# EAGLE design esp32c3-devboard (EAGLE 9.6.2)
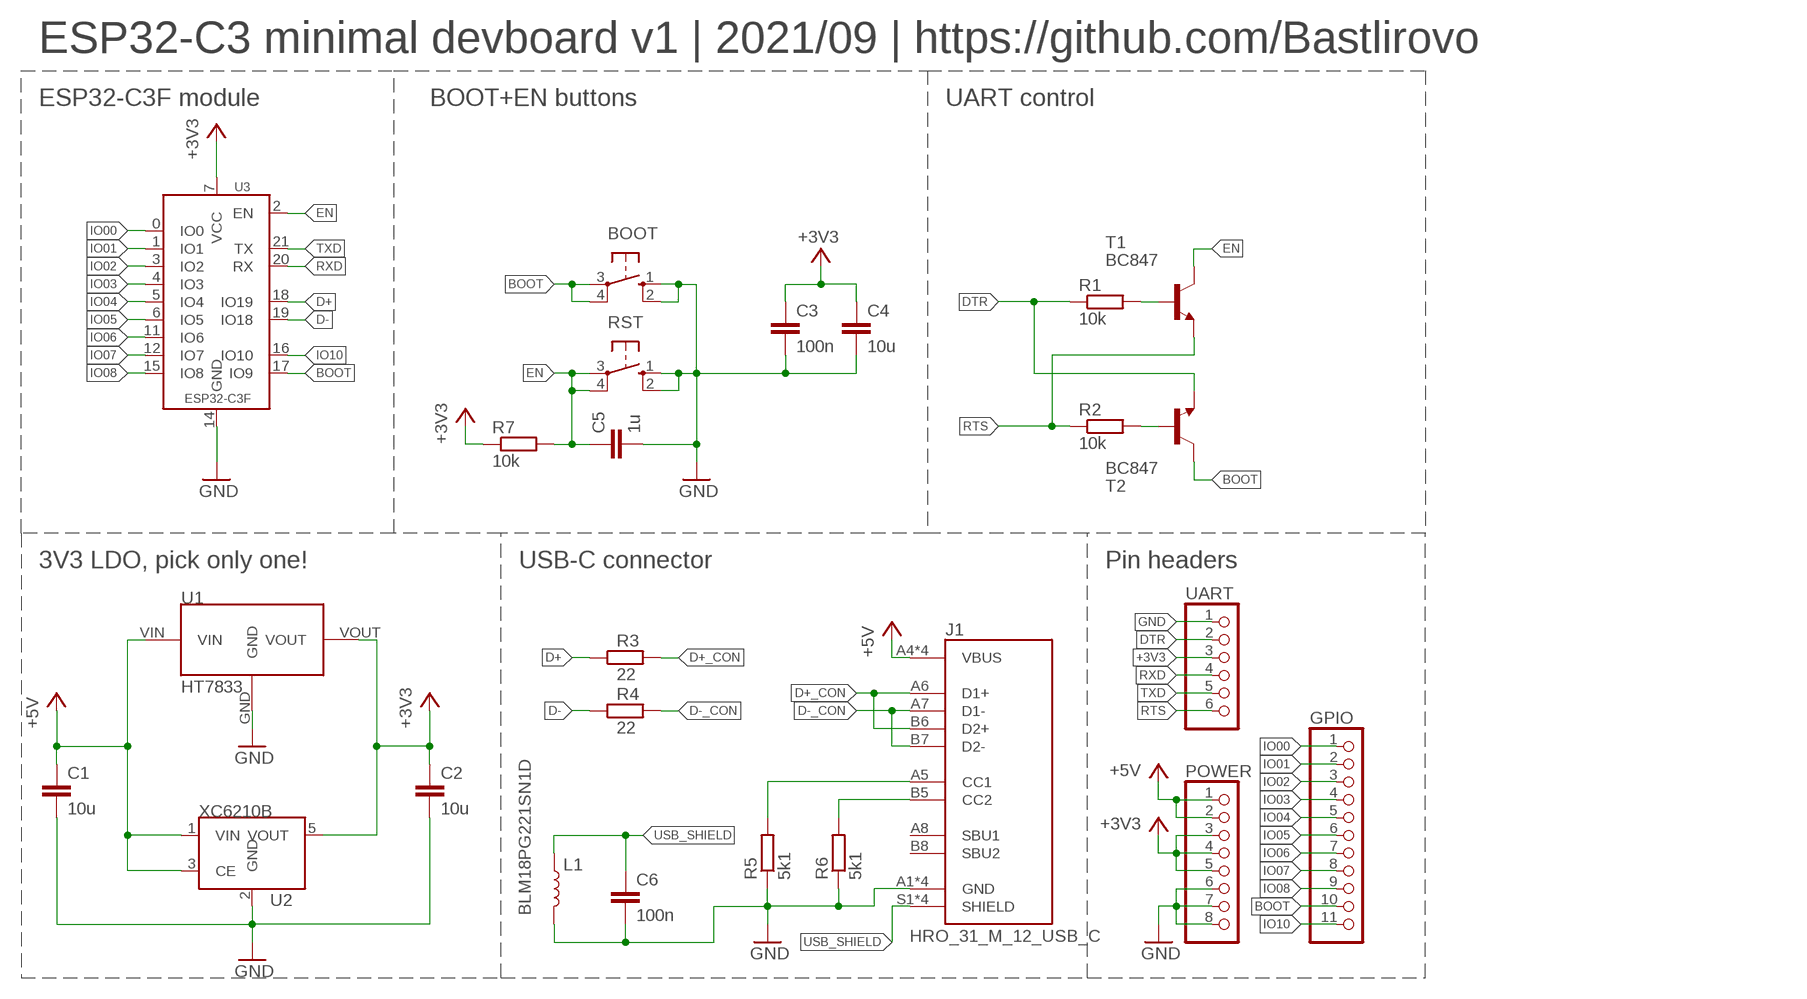
[diagram p0: schematic, sheet 1]

## Parts
BOOT  10-XX  [B3F-10XX]
C1  10u  C-EUC0603  [C0603]
C2  10u  C-EUC0603  [C0603]
C3  100n  C-EUC0603  [C0603]
C4  10u  C-EUC0603  [C0603]
C5  1u  C-EUC0603  [C0603]
C6  100n  C-EUC0603  [C0603]
GPIO  PINHD-1X11  [1X11]
J1  HRO_31_M_12_USB_C  [HRO_31_M_12_USB_C]
L1  BLM18PG221SN1D  INDUCTOR-0603-33NH  [0603]
POWER  PINHD-1X8  [1X08]
R1  10k  R-EU_R0603  [R0603]
R2  10k  R-EU_R0603  [R0603]
R3  22  R-EU_R0603  [R0603]
R4  22  R-EU_R0603  [R0603]
R5  5k1  R-EU_R0603  [R0603]
R6  5k1  R-EU_R0603  [R0603]
R7  10k  R-EU_R0603  [R0603]
RST  10-XX  [B3F-10XX]
T1  BC847  [SOT23]
T2  BC847  [SOT23]
U1  HT7833  [SOT89]
U2  XC6210  [SOT-23-5]
U3  ESP32-C3F  [ESP32-C3F]
UART  PINHD-1X6  [1X06]

## Nets
+3V3: C2.1 C3.1 C4.1 POWER.3 POWER.4 POWER.5 R7.1 U1.VOUT U2.5(VOUT) U3.7(VCC) UART.3
+5V: C1.1 J1.A4(VBUS) J1.A9(VBUS) J1.B4(VBUS) J1.B9(VBUS) POWER.1 POWER.2 U1.VIN U2.1(VIN) U2.3(CE)
BOOT: BOOT.3(P) BOOT.4(P1) GPIO.10 T2.3(C) U3.17(IO9)
D+: R3.1 U3.18(IO19)
D+_CON: J1.A6(D1+) J1.B6(D2+) R3.2
D-: R4.1 U3.19(IO18)
D-_CON: J1.A7(D1-) J1.B7(D2-) R4.2
DTR: R1.1 T2.2(E) UART.2
EN: C5.1 R7.2 RST.3(P) RST.4(P1) T1.3(C) U3.2(EN)
GND: BOOT.1(S) BOOT.2(S1) C1.2 C2.2 C3.2 C4.2 C5.2 C6.2 J1.A1(GND) J1.A12(GND) J1.B1(GND) J1.B12(GND) L1.2 POWER.6 POWER.7 POWER.8 R5.1 R6.1 RST.1(S) RST.2(S1) U1.GND U2.2(GND) U3.14(GND) UART.1
IO00: GPIO.1 U3.0(IO0)
IO01: GPIO.2 U3.1(IO1)
IO02: GPIO.3 U3.3(IO2)
IO03: GPIO.4 U3.4(IO3)
IO04: GPIO.5 U3.5(IO4)
IO05: GPIO.6 U3.6(IO5)
IO06: GPIO.7 U3.11(IO6)
IO07: GPIO.8 U3.12(IO7)
IO08: GPIO.9 U3.15(IO8)
IO10: GPIO.11 U3.16(IO10)
N$2: R2.2 T2.1(B)
N$4: R1.2 T1.1(B)
N$10: J1.A5(CC1) R5.2
N$11: J1.B5(CC2) R6.2
RTS: R2.1 T1.2(E) UART.6
RXD: U3.20(RX) UART.4
TXD: U3.21(TX) UART.5
USB_SHIELD: C6.1 J1.S1(SHIELD) J1.S2(SHIELD) J1.S3(SHIELD) J1.S4(SHIELD) L1.1
Unconnected: J1.A8(SBU1) J1.B8(SBU2)

## Notes on the sheet
- ESP32-C3 minimal devboard v1 | 2021/09 | https://github.com/Bastlirovo
- ESP32-C3F module | BOOT+EN buttons | UART control
- 3V3 LDO, pick only one! | USB-C connector | Pin headers

## Library data of the parts
BOOT RST = switch-omron:10-XX: OMRON SWITCH; MPN: B3F-1000; OC_FARNELL: 176432; OC_NEWARK: 36M3542
C1-C6 = rcl:C-EU: CAPACITOR, European symbol; SPICEPREFIX: C
GPIO = pinhead:PINHD-1X11: PIN HEADER
J1 = Bastlir:HRO_31_M_12_USB_C: USB Shielded I/O Receptacle; Type C; Right Angle; Surface Mount; Gold over Nickel
L1 = SparkFun-Coils:INDUCTOR: Inductors Resist changes in electrical current. Basically a coil of wire. SparkFun Products: SparkFun Load Cell Amplifier - HX711 <https://www.sparkfun.com/products/13879> IOIO-OTG - V2.2 <https://www.sparkfun.com/products/13613>; PROD_ID: NDUC-07874; VALUE: 33nH/±5%/500mA
POWER = pinhead:PINHD-1X8: PIN HEADER
R1-R7 = rcl:R-EU_: RESISTOR, European symbol; SPICEPREFIX: R
T1 T2 = transistor:BC847: NPN TRANSISTOR
U1 = Bastlir:HT7833
U2 = Bastlir:XC6210
U3 = Bastlir:ESP32-C3F
UART = pinhead:PINHD-1X6: PIN HEADER

## Board
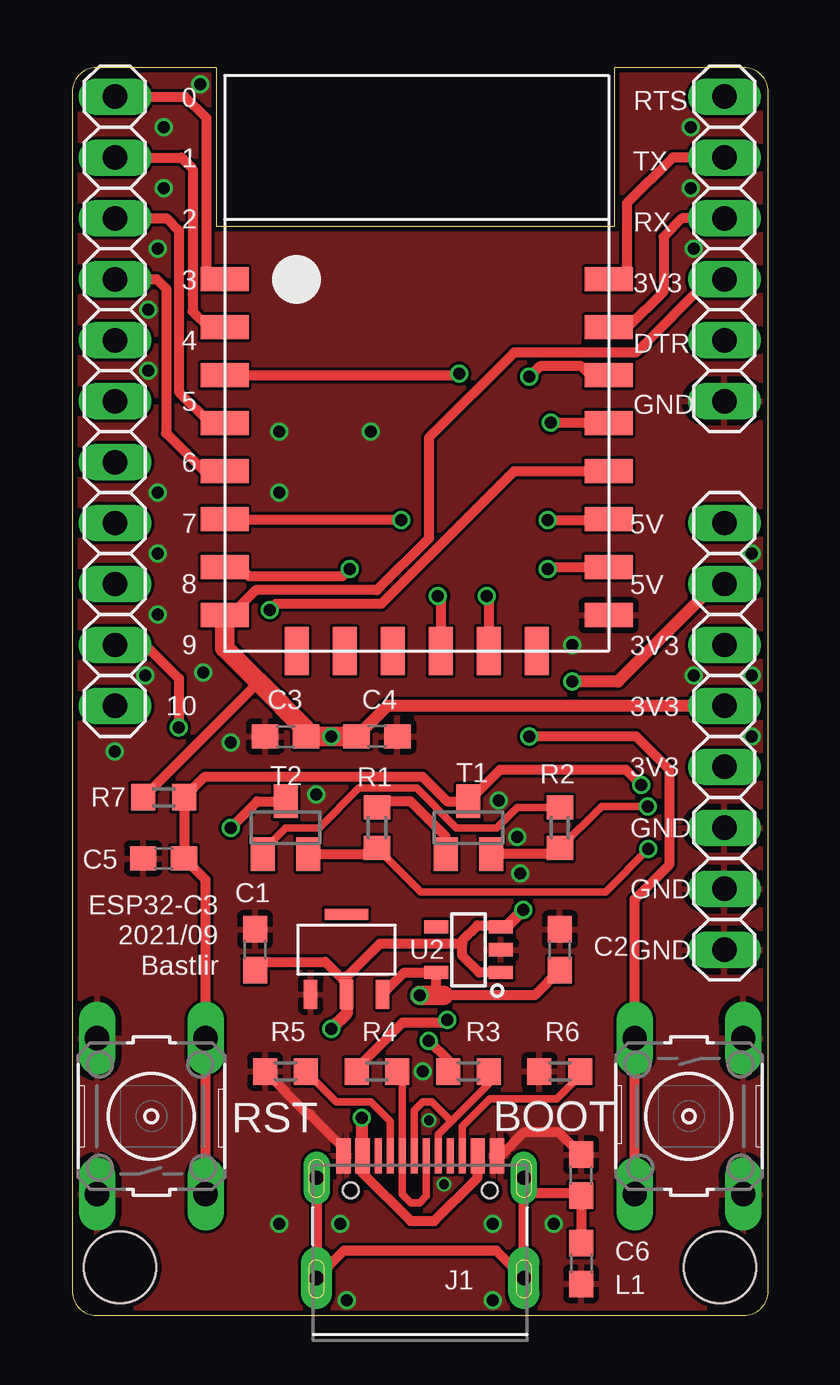
[diagram p1: board, top side]
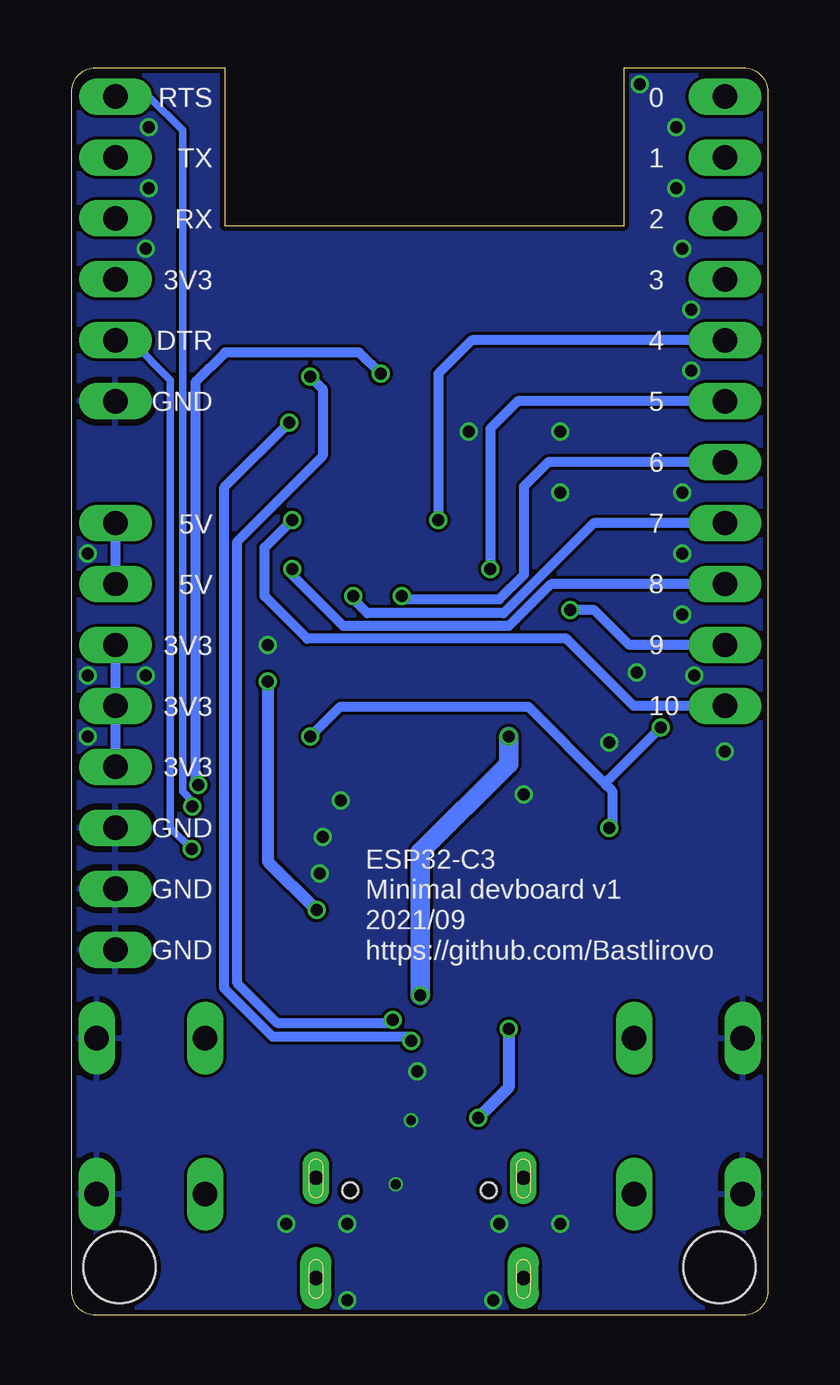
[diagram p2: board, bottom side, seen from below]

Size 29 x 52 mm. Coordinates in mm from the lower left corner, seen from the top.
Outline: 0,51 0,1 arc90 1,0 28,0 arc90 29,1 29,51 arc90 28,52 22.6,52 22.6,45.4 6,45.4 6,52 1,52 arc90 0,51
Copper layers (1*16): Top 0.035559375mm / dielectric 1.6mm / Bottom 0.035559375mm
Design rules "jlcpcb2layer": minimum track width 5mil, minimum drill 12mil, track to track 5mil, track to pad 5mil, pad to pad 5mil, via to via 5mil, smd to smd 5mil, copper to edge 8mil, drill to drill 6mil, minimum pad ring 5mil, minimum via ring 3mil, stop-mask expansion 2.5mil, vias tented up to drill 0mil, thermal gap 10mil
Holes 3 mm at 2,2 27,2

### Footprints (pad centres in the part's own frame; a part is rotated, then mirrored left to right if it is on the bottom)
B3F-10XX = drill 1.016 long: 1 -3.251,2.261; 2 3.251,2.261; 3 -3.251,-2.261; 4 3.251,-2.261
C0603 = smd 1.1 x 1: 1 -0.85,0; 2 0.85,0
1X11 = drill 1.016 long: 1 -12.7,0; 2 -10.16,0; 3 -7.62,0; 4 -5.08,0; 5 -2.54,0; 6 0,0; 7 2.54,0; 8 5.08,0; 9 7.62,0; 10 10.16,0; 11 12.7,0
HRO_31_M_12_USB_C = smd 0.3 x 1.45: A1 -3.35,4.045; A4 -2.55,4.045; A5 -1.25,4.045; A6 -0.25,4.045; A7 0.25,4.045; A8 1.25,4.045; A9 2.55,4.045; A12 3.35,4.045; B1 3.05,4.045; B4 2.25,4.045; B5 1.75,4.045; B6 0.75,4.045; B7 -0.75,4.045; B8 -1.75,4.045; B9 -2.25,4.045; B12 -3.05,4.045 | drill 0.6 pad 1.1 long: S1 -4.32,3.13; S2 4.32,3.13 | drill 0.6 pad 1.3 long: S3 -4.32,-1.05; S4 4.32,-1.05 | hole 0.65: -2.89,2.6; 2.89,2.6
0603 = smd 1.1 x 1: 1 -0.85,0; 2 0.85,0
1X08 = drill 1.016 long: 1 -8.89,0; 2 -6.35,0; 3 -3.81,0; 4 -1.27,0; 5 1.27,0; 6 3.81,0; 7 6.35,0; 8 8.89,0
R0603 = smd 1 x 1.1: 1 -0.85,0; 2 0.85,0
SOT23 = smd 1 x 1.4: 1 -0.95,-1.1; 2 0.95,-1.1; 3 0,1.1
SOT89 = smd 0.559 x 1.194: GND -1.499,-0.597; VIN 0,-0.597; VOUT 1.499,-0.597 | smd 1.829 x 0.457: P$4 0,2.743
SOT-23-5 = smd 1 x 0.55: 1 -1.35,0.95; 2 -1.35,0; 3 -1.35,-0.95; 4 1.35,-0.95; 5 1.35,0.95
ESP32-C3F = smd 2 x 1: 0 -7.62,5.08; 1 -7.62,3.08; 2 -7.62,1.08; 3 -7.62,-0.92; 4 -7.62,-2.92; 5 -7.62,-4.92; 6 -7.62,-6.92; 7 -7.62,-8.92; 14 8.38,-8.92; 15 8.38,-6.92; 16 8.38,-4.92; 17 8.38,-2.92; 18 8.38,-0.92; 19 8.38,1.08; 20 8.38,3.08; 21 8.38,5.08 | smd 1 x 2: 8 -4.62,-10.42; 9 -2.62,-10.42; 10 -0.62,-10.42; 11 1.38,-10.42; 12 3.38,-10.42; 13 5.38,-10.42
1X06 = drill 1.016 long: 1 -6.35,0; 2 -3.81,0; 3 -1.27,0; 4 1.27,0; 5 3.81,0; 6 6.35,0

### Placement (x,y rotation side)
BOOT  25.7,8.3 270 top
C1  7.62,15.24 90 top
C2  20.32,15.24 90 top
C3  8.89,24.13 180 top
C4  12.7,24.13 0 top
C5  3.81,19.05 180 top
C6  21.21,5.84 90 top
GPIO  1.78,38.1 270 top
J1  14.5,2.6 0 top
L1  21.21,2.16 270 top
POWER  27.18,24.13 270 top
R1  12.7,20.32 90 top
R2  20.32,20.32 90 top
R3  16.51,10.16 0 top
R4  12.7,10.16 0 top
R5  8.89,10.16 0 top
R6  20.32,10.16 0 top
R7  3.81,21.59 0 top
RST  3.3,8.3 90 top
T1  16.51,20.32 0 top
T2  8.89,20.32 0 top
U1  11.43,13.97 0 top
U2  16.51,15.24 180 top
U3  13.97,38.1 0 top
UART  27.18,44.45 90 top

### Tracks (layer width: path | path; a pad name or v marks a point on that pad's centre or on a via)
+3V3  (via drill 0.5)
  Top 0.406: U1.VOUT 13.85,14.29 U2.5 15.16,13.65 15.48,13.34 19.27,13.34 C2.1 | R7.1 7.75,26.38 7.75,26.42 | UART.3 26.54,43.18 23.5,40.13 18.41,40.13 14.86,36.58 14.86,32.38 12.7,30.23 7.65,30.23 6.6,29.18 U3.7
  Top 0.508: POWER.4 13.12,25.4 C4.1
  Top 0.813: U3.7 6.35,27.81 7.75,26.42 9.74,24.42 C3.1 v10.79,24.13 C4.1 | v14.48,13.34 15.48,13.34
  Bottom 0.406: POWER.3 POWER.4 POWER.5
  Bottom 0.813: v10.79,24.13 10.79,22.99 14.48,19.3 v14.48,13.34
+5V  (via drill 0.5)
  Top 0.305: J1.A9 J1.B4 16.89,6.5 16.89,5.97 | J1.B9 J1.A4 12.06,6.53 12.06,5.97
  Top 0.406: C1.1 7.96,14.73 10.54,14.73 11.43,13.84 U1.VIN | U2.1 16.95,14.29 16.26,14.99 16.26,15.49 | 16.26,15.49 16.26,15.62 16.89,16.26 17.79,16.26 U2.3 | 12.06,5.97 14.1,3.94 15.09,3.94 16.89,5.74 16.89,5.97 | 16.26,15.49 12.83,15.49 11.43,14.1
  Top 0.508: POWER.2 26.8,30.48 22.73,26.42 v20.83,26.42 | v18.8,16.89 18.09,16.19 U2.3 | 11.43,14.1 U1.VIN 11.43,12.57 v10.79,11.94 | v12.06,8.24 12.06,6.53
  Bottom 0.406: POWER.1 POWER.2
  Bottom 0.508: v20.83,26.42 20.83,18.92 v18.8,16.89 | v10.79,11.94 10.79,9.51 v12.06,8.24
BOOT  (via drill 0.5)
  Top 0.406: v8.23,29.39 8.49,29.65 12.88,29.65 18.42,35.18 U3.17 | BOOT.4 BOOT.3 23.44,17.34 24.89,18.8 24.89,22.73 23.5,24.13 v19.05,24.13 | v6.6,20.32 7.7,21.42 T2.3 | GPIO.10 3.05,27.94 4.45,26.54 v4.45,24.51
  Bottom 0.406: GPIO.10 5.76,27.94 7.22,29.39 v8.23,29.39 | 6.78,22.17 9.98,25.38 17.8,25.38 v19.05,24.13 | v4.45,24.51 6.78,22.17 | v6.6,20.32 6.48,20.45 6.48,21.87 6.78,22.17
D+  (via drill 0.5)
  Top 0.406: R3.1 15.66,10.64 v14.86,11.44 | v19.94,37.21 22.32,37.21 U3.18
  Bottom 0.406: v14.86,11.44 15.03,11.61 20.62,11.61 22.63,13.62 22.63,34.52 v19.94,37.21
D+_CON
  Top 0.305: J1.A6 14.25,8.54 14.61,8.89 14.99,8.89 15.79,8.08 | R3.2 17.36,9.65 15.79,8.08 | 15.79,8.08 15.25,7.54 J1.B6
D-  (via drill 0.5)
  Top 0.406: R4.1 11.85,10.29 13.76,12.19 15.49,12.19 v15.62,12.32 | v19.05,39.12 19.5,39.56 21.21,39.56 21.59,39.18 U3.19
  Bottom 0.406: v15.62,12.32 15.75,12.19 20.45,12.19 22.1,13.84 22.1,32.26 18.54,35.81 18.54,38.61 v19.05,39.12
D-_CON
  Top 0.305: J1.A7 14.75,4.97 14.48,4.7 14.1,4.7 13.75,5.05 J1.B7 13.75,9.96 R4.2
DTR  (via drill 0.5)
  Top 0.305: R1.1 14.52,17.65 22.23,17.65 v24,19.43
  Top 0.406: T2.2 12.45,19.22 R1.1
  Bottom 0.305: v24,19.43 24.89,20.32 24.89,38.99 26.54,40.64 UART.2
EN  (via drill 0.5)
  Top 0.406: U3.2 16.07,39.18 v16.13,39.24 | v23.72,22.1 23.08,22.73 17.82,22.73 T1.3 15.62,21.42 14.59,22.45 5.52,22.45 R7.2 C5.1 5.56,18.15 RST.4 RST.3
  Bottom 0.406: v16.13,39.24 17.02,40.13 22.61,40.13 23.84,38.89 23.84,22.23 v23.72,22.1
GND  (via drill 0.4, 0.5)
  Top 0.254: J1.A12 J1.B1 | J1.A1 J1.B12
  Top 0.406: R5.1 9.82,8.38 9.91,8.38 11.3,6.99 11.3,6.64 | C6.2 20.28,7.62 18.82,7.62 J1.A12
  other vias: 3.81,49.53 3.81,46.99 3.56,44.45 3.56,34.29 3.56,31.75 3.56,29.21 5.46,26.8 11.18,3.81 17.53,3.81 8.64,3.81 20.07,3.81 3.17,41.91 3.17,39.37 5.33,51.31 25.78,49.53 25.78,46.99 25.91,26.67 20.83,27.94 28.32,26.67 28.32,24.13 28.32,31.75 14.61,10.16 11.43,0.64 17.53,0.64 17.78,21.46 18.67,18.41 8.64,34.29 8.64,36.83 12.45,36.83 6.6,23.88 1.78,23.5 3.05,26.67 25.91,44.45 10.16,21.72 18.54,19.94 14.86,8.13 15.49,5.46
  pour Top: -1.27,-3.81 31.75,-3.81 31.75,53.34 -1.27,53.34
  pour Bottom: -2.54,-5.08 33.02,-5.08 33.02,54.61 -2.54,54.61
IO00
  Top 0.406: GPIO.1 4.7,50.8 5.59,49.91 5.59,43.56 5.97,43.18 U3.0
IO01
  Top 0.406: GPIO.2 4.55,48.26 5.02,47.79 5.02,42.54 5.02,41.84 5.68,41.18 U3.1
IO02
  Top 0.406: GPIO.3 3.94,45.72 4.45,45.21 4.45,38.48 5.75,37.18 U3.3
IO03
  Top 0.406: GPIO.4 3.53,43.18 3.91,42.8 3.91,36.76 5.49,35.18 U3.4
IO04  (via drill 0.5)
  Top 0.406: v13.72,33.15 6.38,33.15 U3.5
  Bottom 0.406: GPIO.5 12.32,40.64 13.72,39.24 v13.72,33.15
IO05  (via drill 0.5)
  Top 0.406: v11.56,31.11 11.24,30.8 7.37,30.8 6.99,31.18 U3.6
  Bottom 0.406: GPIO.6 10.41,38.1 11.56,36.96 v11.56,31.11
IO06  (via drill 0.5)
  Top 0.406: v15.24,29.97 15.35,29.86 U3.11
  Bottom 0.406: GPIO.7 9.14,35.56 10.16,34.54 10.16,30.86 11.18,29.84 15.11,29.84 v15.24,29.97
IO07  (via drill 0.5)
  Top 0.406: v17.27,29.97 17.35,29.89 U3.12
  Bottom 0.406: GPIO.8 7.25,33.02 11,29.27 16.68,29.27 17.27,29.86 v17.27,29.97
IO08  (via drill 0.5)
  Top 0.406: v19.81,31.11 19.88,31.18 U3.15
  Bottom 0.406: GPIO.9 9.03,30.48 10.78,28.73 17.68,28.73 19.81,30.86 v19.81,31.11
IO10  (via drill 0.5)
  Top 0.406: v19.81,33.15 22.32,33.15 U3.16
  Bottom 0.406: GPIO.11 5.59,25.4 8.39,28.2 19.18,28.2 20.95,29.97 20.95,32 v19.81,33.15
N$2
  Top 0.305: R2.2 18.54,21.17 17.69,20.32 16,20.32 14.35,21.97 11.94,21.97 10.29,20.32 8.89,20.32 7.94,19.37 T2.1
N$4
  Top 0.406: R1.2 12.95,21.42 14.1,21.42 15.56,19.96 T1.1
N$10
  Top 0.305: J1.A5 13.25,8.09 12.45,8.89 11.01,8.89 R5.2
N$11
  Top 0.305: J1.B5 16.25,7.87 17.4,9.02 20.19,9.02 21.17,9.99 R6.2
RTS  (via drill 0.5)
  Top 0.305: v23.97,21.21 22.06,21.21 R2.1
  Top 0.406: R2.1 20.07,19.22 T1.2
  Bottom 0.305: UART.6 25.78,50.8 24.37,49.39 24.37,21.83 23.97,21.43 v23.97,21.21
RXD
  Top 0.406: UART.4 25.4,45.72 24.64,44.96 24.64,42.67 23.15,41.18 U3.20
TXD
  Top 0.406: UART.5 25.02,48.26 23.11,46.35 23.11,43.43 22.86,43.18 U3.21
USB_SHIELD
  Top 0.406: L1.1 C6.1 21.12,5.08 18.82,5.08 | 18.82,5.08 J1.S4 17.68,2.69 11.32,2.69 J1.S3 J1.S1 | 18.82,5.08 J1.S2

### Text on the board
tPlace: 0 / / 1 / / 2 / / 3 / / 4 / / 5 / / 6 / / 7 / / 8 / / 9 / / 10 | RTS / / TX / / RX / / 3V3 / / DTR / / GND | 5V / / 5V / / 3V3 / / 3V3 / / 3V3 / / GND / / GND / / GND | ESP32-C3 / 2021/09 / Bastlir
bPlace: 0 / / 1 / / 2 / / 3 / / 4 / / 5 / / 6 / / 7 / / 8 / / 9 / / 10 | RTS / / TX / / RX / / 3V3 / / DTR / / GND | 5V / / 5V / / 3V3 / / 3V3 / / 3V3 / / GND / / GND / / GND | ESP32-C3 / Minimal devboard v1 / 2021/09 / https://github.com/Bastlirovo